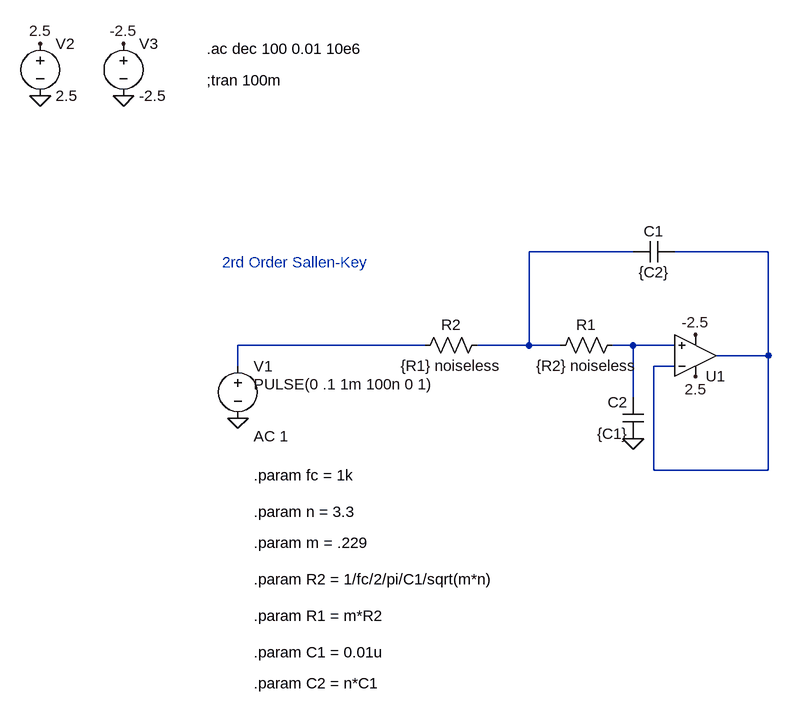
[diagram p0: schematic sallen_key_2nd_order_general.asc]
sallen_key_2nd_order_general.asc, the LTspice schematic file:
Version 4
SHEET 1 1276 856
WIRE 464 0 304 0
WIRE 672 0 528 0
WIRE 144 144 -144 144
WIRE 304 144 304 0
WIRE 304 144 224 144
WIRE 352 144 304 144
WIRE 464 144 432 144
WIRE 528 144 464 144
WIRE 672 160 672 0
WIRE 672 160 592 160
WIRE -144 176 -144 144
WIRE 528 176 496 176
WIRE 464 224 464 144
WIRE 496 336 496 176
WIRE 672 336 672 160
WIRE 672 336 496 336
FLAG 560 192 2.5
FLAG 560 128 -2.5
FLAG 464 288 0
FLAG -144 256 0
FLAG -448 -320 2.5
FLAG -320 -320 -2.5
FLAG -448 -240 0
FLAG -320 -240 0
SYMBOL Opamps\\UniversalOpamp2 560 160 M180
SYMATTR InstName U1
SYMBOL res 448 128 R90
WINDOW 0 0 56 VBottom 2
WINDOW 3 32 56 VTop 2
SYMATTR InstName R1
SYMATTR Value {R2} noiseless
SYMBOL res 240 128 R90
WINDOW 0 0 56 VBottom 2
WINDOW 3 32 56 VTop 2
SYMATTR InstName R2
SYMATTR Value {R1} noiseless
SYMBOL cap 528 -16 R90
WINDOW 0 0 32 VBottom 2
WINDOW 3 32 32 VTop 2
SYMATTR InstName C1
SYMATTR Value {C2}
SYMBOL cap 480 288 R180
WINDOW 0 24 56 Left 2
WINDOW 3 24 8 Left 2
SYMATTR InstName C2
SYMATTR Value {C1}
SYMBOL voltage -144 160 R0
WINDOW 123 24 124 Left 2
WINDOW 39 0 0 Left 0
WINDOW 3 24 44 Left 2
SYMATTR Value2 AC 1
SYMATTR Value PULSE(0 .1 1m 100n 0 1)
SYMATTR InstName V1
SYMBOL voltage -448 -336 R0
WINDOW 123 0 0 Left 0
WINDOW 39 0 0 Left 0
SYMATTR InstName V2
SYMATTR Value 2.5
SYMBOL voltage -320 -336 R0
WINDOW 123 0 0 Left 0
WINDOW 39 0 0 Left 0
SYMATTR InstName V3
SYMATTR Value -2.5
TEXT -168 16 Left 2 ;2rd Order Sallen-Key
TEXT -120 344 Left 2 !.param fc = 1k
TEXT -192 -312 Left 2 !.ac dec 100 0.01 10e6
TEXT -192 -264 Left 2 !;tran 100m
TEXT -120 504 Left 2 !.param R2 = 1/fc/2/pi/C1/sqrt(m*n)
TEXT -120 616 Left 2 !.param C1 = 0.01u
TEXT -120 400 Left 2 !.param n = 3.3
TEXT -120 448 Left 2 !.param m = .229
TEXT -120 664 Left 2 !.param C2 = n*C1
TEXT -120 560 Left 2 !.param R1 = m*R2

The netlist it stands for:
* sallen_key_2nd_order_general.asc
XU1 N004 N002 2.5 -2.5 N002 level.2 Avol=1Meg GBW=10Meg Slew=10Meg ilimit=25m rail=0 Vos=0 phimargin=45 en=0 enk=0 in=0 ink=0 Rin=500Meg  ; pins IN+ IN- V+ V- OUT
R1 N004 N001 {R2} noiseless
R2 N001 N003 {R1} noiseless
C1 N002 N001 {C2}
C2 0 N004 {C1}
V1 N003 0 PULSE(0 .1 1m 100n 0 1) AC 1
V2 2.5 0 2.5
V3 -2.5 0 -2.5
* 2rd Order Sallen-Key
.param fc = 1k
.ac dec 100 0.01 10e6
;tran 100m
.param R2 = 1/fc/2/pi/C1/sqrt(m*n)
.param C1 = 0.01u
.param n = 3.3
.param m = .229
.param C2 = n*C1
.param R1 = m*R2
.lib UniversalOpamps2.sub
.backanno
.end